# Altium schematic sheet DC075B_USB.SchDoc: USB<->SPI
size 558 x 431 mm; DrawnBy: Praveen Aroul; DocumentNumber: 2; SheetNumber: 2; SheetTotal: 13; PageSetup: Record=PageOptions|CenterHorizontal=True|CenterVertical=True|PrintScale=1.00|XCorrection=1.00|YCorrection=1.00|PrintKind=0|BorderSize=5000000|LeftOffset=0|BottomOffset=0|Orientation=2|PaperLength=1000|PaperWidth=1000|Scale=100|PaperSource=15|PrintQuality=600|MediaType=1|DitherType=10|PaperKind=Letter|PrintScaleMode=1
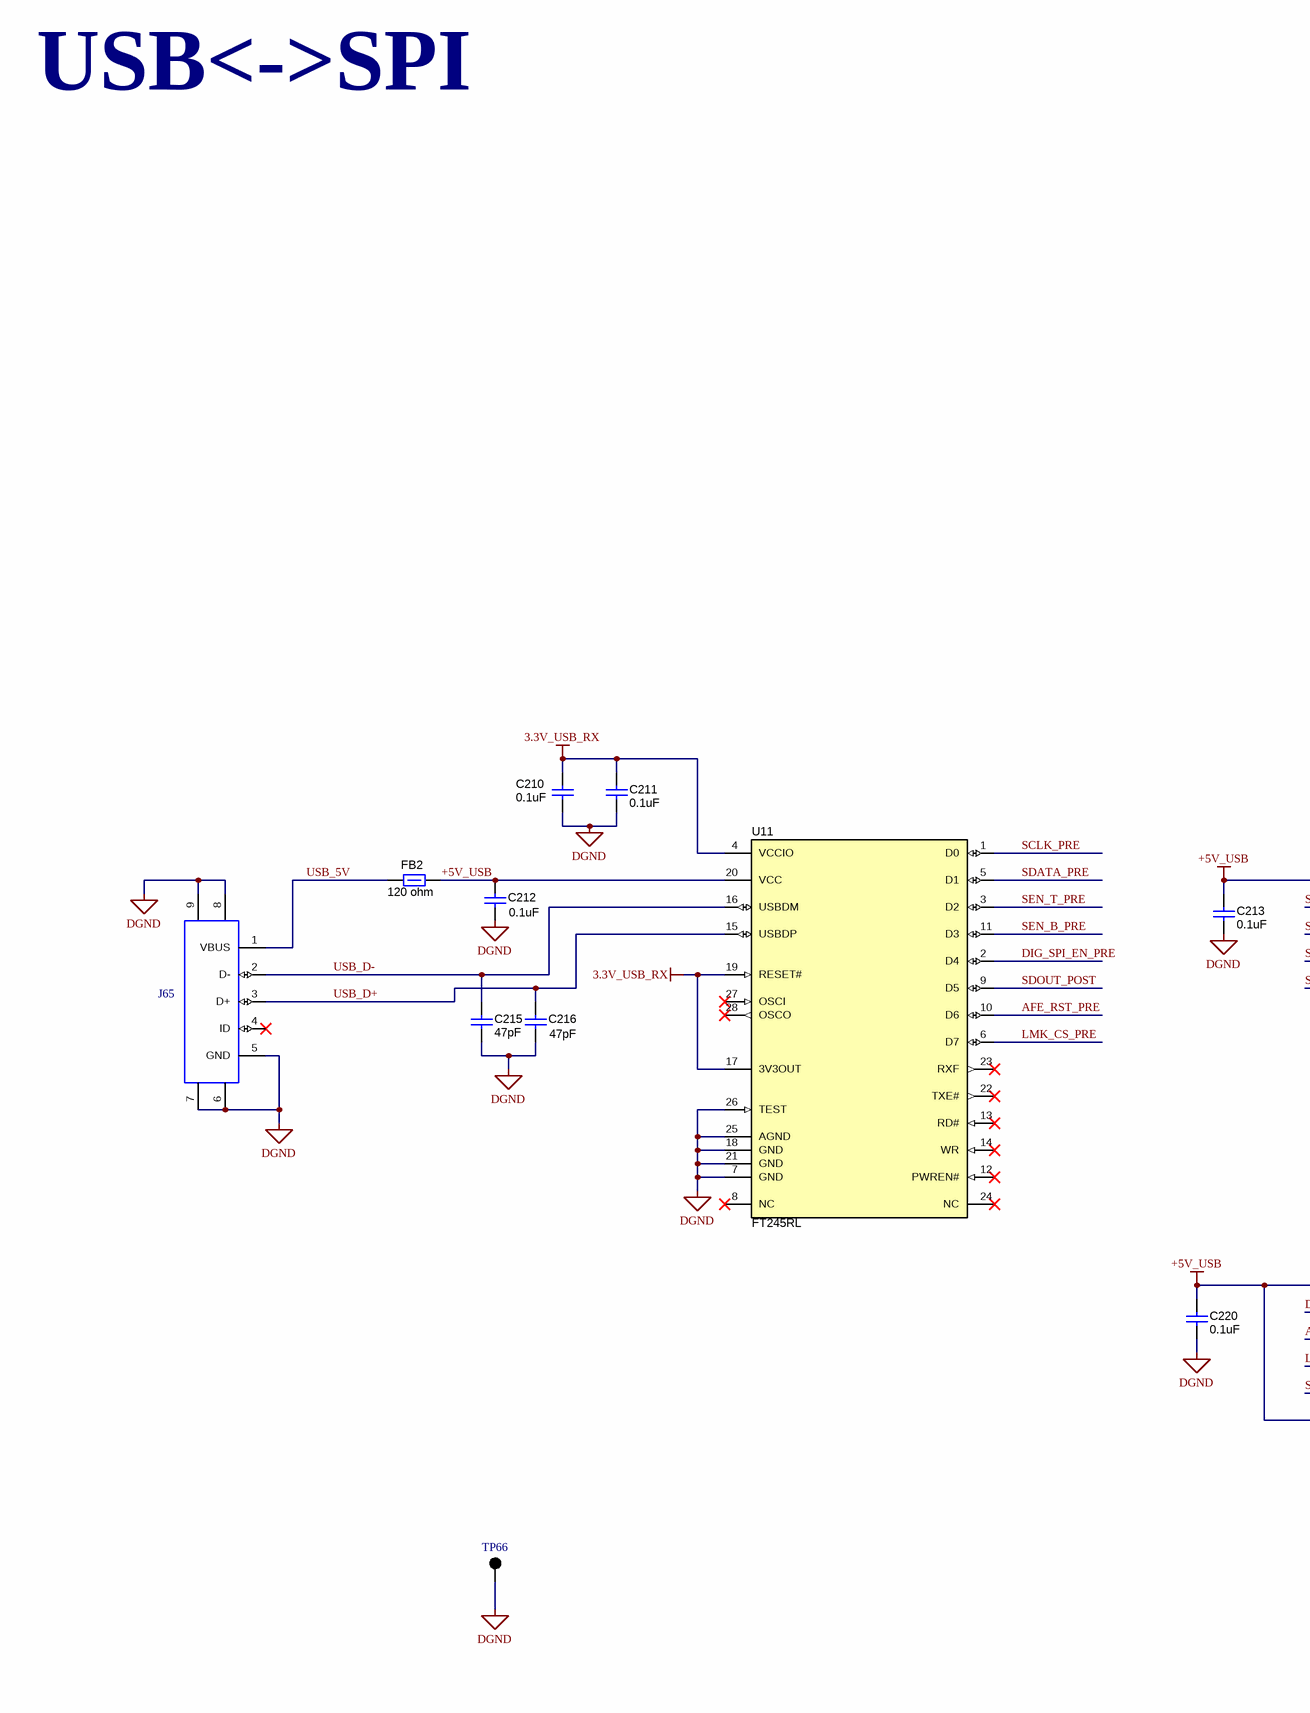
[diagram p0: DC075B_USB.SchDoc, left]
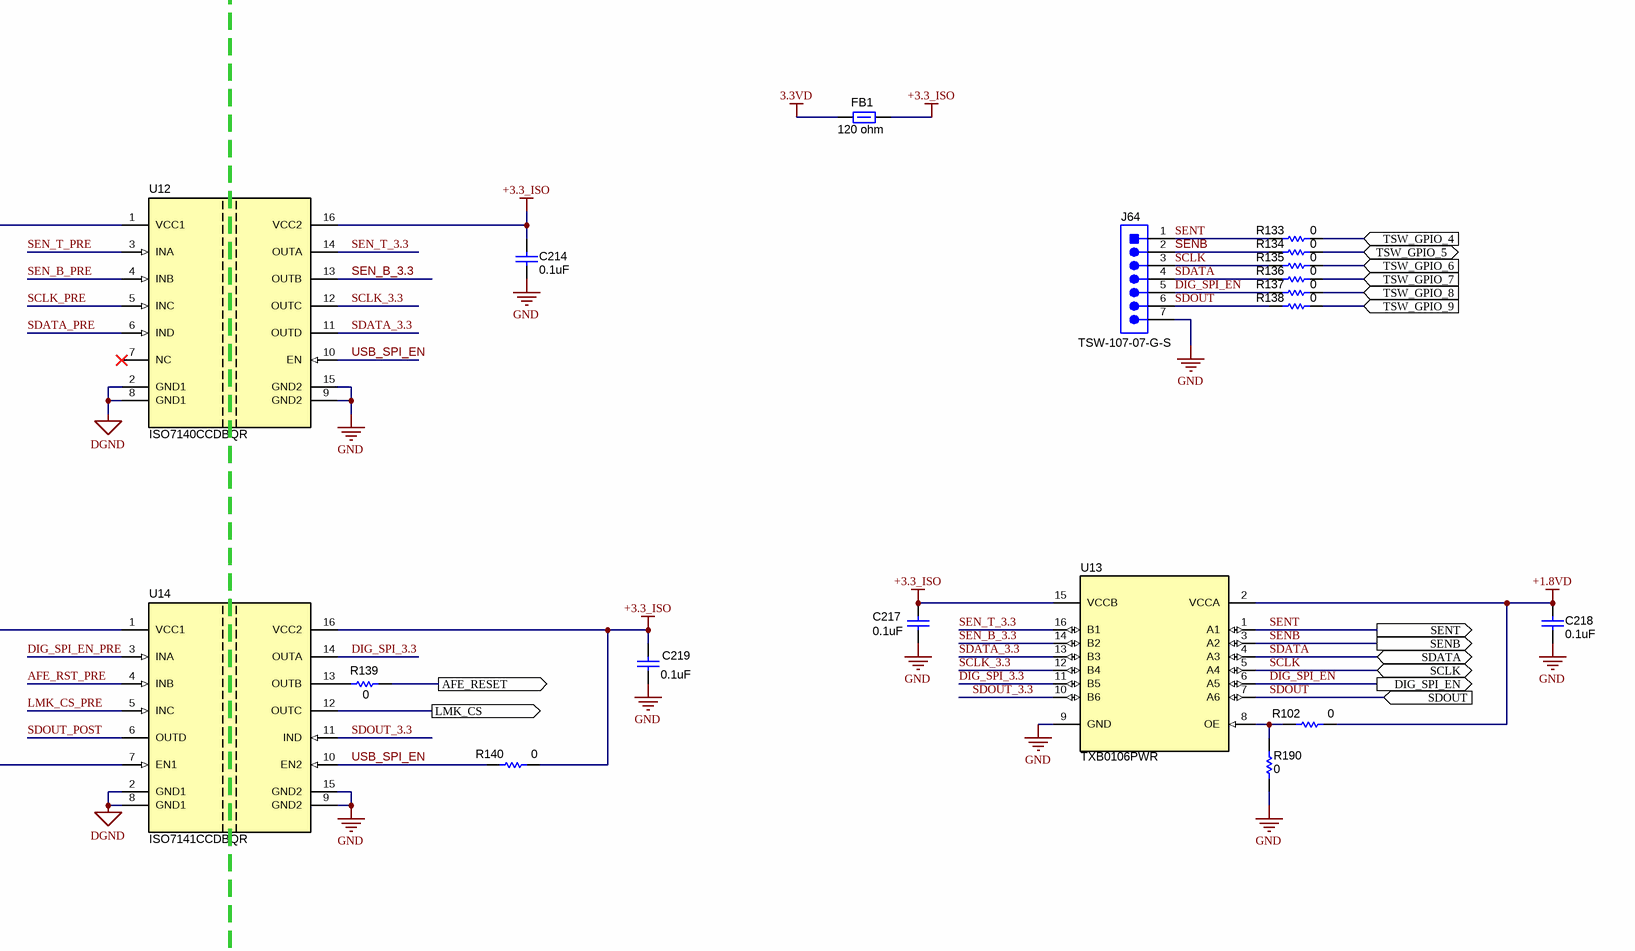
[diagram p1: DC075B_USB.SchDoc, right]

## Parts
C210  value 0.1uF  [0402]  (hidden comment: GRM155R71C104KA88D)
C211  value 0.1uF  [0402]  (hidden comment: GRM155R71C104KA88D)
C212  value 0.1uF  [0402]  (hidden comment: GRM155R71C104KA88D)
C213  value 0.1uF  [0402]  (hidden comment: GRM155R71C104KA88D)
C214  value 0.1uF  [0402]  (hidden comment: GRM155R71C104KA88D)
C215  value 47pF  [0402]  (hidden comment: GRM1555C1H470FA01D)
C216  value 47pF  [0402]  (hidden comment: GRM1555C1H470FA01D)
C217  value 0.1uF  [0402]  (hidden comment: GRM155R71C104KA88D)
C218  value 0.1uF  [0402]  (hidden comment: GRM155R71C104KA88D)
C219  value 0.1uF  [0402]  (hidden comment: GRM155R71C104KA88D)
C220  value 0.1uF  [0402]  (hidden comment: GRM155R71C104KA88D)
FB1  value 120 ohm  [0805]  (hidden comment: BLM21AG121SN1D)
FB2  value 120 ohm  [0805]  (hidden comment: BLM21AG121SN1D)
J64  TSW-107-07-G-S  [TSW-107-07-G-S]
J65  67803-8020  [Molex_67803-8020]  (value not drawn)
R102  value 0  [0402]  (hidden comment: CRCW04020000Z0ED)
R133  value 0  [0402]  (hidden comment: CRCW04020000Z0ED)
R134  value 0  [0402]  (hidden comment: CRCW04020000Z0ED)
R135  value 0  [0402]  (hidden comment: CRCW04020000Z0ED)
R136  value 0  [0402]  (hidden comment: CRCW04020000Z0ED)
R137  value 0  [0402]  (hidden comment: CRCW04020000Z0ED)
R138  value 0  [0402]  (hidden comment: CRCW04020000Z0ED)
R139  value 0  [0402]  (hidden comment: CRCW04020000Z0ED)
R140  value 0  [0402]  (hidden comment: CRCW04020000Z0ED)
R190  value 0  [0402]  (hidden comment: CRCW04020000Z0ED)
TP66  5001  [Keystone5001]  (value not drawn)
U11  FT245RL  [SSOP28_N]
U12  ISO7140CCDBQR  [DBQ0016A_N]
U13  TXB0106PWR  [PW0016A_N]
U14  ISO7141CCDBQR  [DBQ0016A_N]

## Ports
AFE_RESET (out), DIG_SPI_EN (out), LMK_CS (out), SCLK, SDATA, SDOUT (in), SENB (out), SENT (out), TSW_GPIO_4 (in), TSW_GPIO_5, TSW_GPIO_6 (in), TSW_GPIO_7 (in), TSW_GPIO_8 (in), TSW_GPIO_9 (in)

## Nets
3.3V_USB_RX: C210.2 C211.2 U11.4(VCCIO) U11.17(3V3OUT) U11.19(RESET#)
3.3VD: FB1.2
+1.8VD: C218.2 R102.1 U13.2(VCCA)
+3.3_ISO: C214.2 C217.2 C219.2 FB1.1 R140.1 U12.16(VCC2) U13.15(VCCB) U14.16(VCC2)
+5V_USB: C212.1 C213.1 C220.1 FB2.1 U11.20(VCC) U12.1(VCC1) U14.1(VCC1) U14.7(EN1)
DGND: C210.1 C211.1 C212.2 C213.2 C215.2 C216.2 C220.2 J65.5(GND) J65.6 J65.7 J65.8 J65.9 TP66.1 U11.7(GND) U11.18(GND) U11.21(GND) U11.25(AGND) U11.26(TEST) U12.2(GND1) U12.8(GND1) U14.2(GND1) U14.8(GND1)
GND: C214.1 C217.1 C218.1 C219.1 J64.7 R190.2 U12.9(GND2) U12.15(GND2) U13.9(GND) U14.9(GND2) U14.15(GND2)
AFE_RESET: R139.1 ; port AFE_RESET
AFE_RST_PRE: U11.10(D6) U14.4(INB)
DIG_SPI_3.3: U13.11(B5) U14.14(OUTA)
DIG_SPI_EN: J64.5 R137.2 U13.6(A5) ; port DIG_SPI_EN
DIG_SPI_EN_PRE: U11.2(D4) U14.3(INA)
LMK_CS: U14.12(OUTC) ; port LMK_CS
LMK_CS_PRE: U11.6(D7) U14.5(INC)
SCLK: J64.3 R135.2 U13.5(A4) ; port SCLK
SCLK_3.3: U12.12(OUTC) U13.12(B4)
SCLK_PRE: U11.1(D0) U12.5(INC)
SDATA: J64.4 R136.2 U13.4(A3) ; port SDATA
SDATA_3.3: U12.11(OUTD) U13.13(B3)
SDATA_PRE: U11.5(D1) U12.6(IND)
SDOUT: J64.6 R138.2 U13.7(A6) ; port SDOUT
SDOUT_3.3: U13.10(B6) U14.11(IND)
SDOUT_POST: U11.9(D5) U14.6(OUTD)
SEN_B_3.3: U12.13(OUTB) U13.14(B2)
SEN_B_PRE: U11.11(D3) U12.4(INB)
SEN_T_3.3: U12.14(OUTA) U13.16(B1)
SEN_T_PRE: U11.3(D2) U12.3(INA)
SENB: J64.2 R134.2 U13.3(A2) ; port SENB
SENT: J64.1 R133.2 U13.1(A1) ; port SENT
TSW_GPIO_4: R133.1 ; port TSW_GPIO_4
TSW_GPIO_5: R134.1 ; port TSW_GPIO_5
TSW_GPIO_6: R135.1 ; port TSW_GPIO_6
TSW_GPIO_7: R136.1 ; port TSW_GPIO_7
TSW_GPIO_8: R137.1 ; port TSW_GPIO_8
TSW_GPIO_9: R138.1 ; port TSW_GPIO_9
USB_5V: FB2.2 J65.1(VBUS)
USB_D+: C216.1 J65.3(D+) U11.15(USBDP)
USB_D-: C215.1 J65.2(D-) U11.16(USBDM)
USB_SPI_EN: R140.2 U12.10(EN) U14.10(EN2)
NetR102_2: R102.2 R190.1 U13.8(OE)
NetR139_2: R139.2 U14.13(OUTB)

Not connected (* = marked no-connect by the designer): J65 4(ID)*; U11 8(NC)* 12(PWREN#)* 13(RD#)* 14(WR)* 22(TXE#)* 23(RXF)* 24(NC)* 27(OSCI)* 28(OSCO)*; U12 7(NC)*

## Notes on the sheet
- USB<->SPI
- Drawn By:
- SVN Rev:
- Number:
- TID #:
- Orderable:
- Rev:
- Sheet Title:
- File:
- Project Title:
- Designed for:
- Assembly Variant:
- Mod. Date:
- Sheet:
- Size:
- of
- C
- http://www.ti.com
- Texas Instruments and/or its licensors do not warrant the accuracy or completeness of this specification or any information contained therein. Texas Instruments and/or its licensors do not warrant that this design will meet the specifications, will be suitable for your application or fit for any particular purpose, or will operate in an implementation. Texas Instruments and/or its licensors do not warrant that the design is production worthy. You should completely validate and test your design implementation to confirm the system functionality for your application.
- Engineer:
- Contact:
- © Texas Instruments

## Library data of the parts
C210-C214 C217-C220 = CMP-0006641-2: CAP, CERM, 0.1 uF, 16 V, +/- 10%, X7R, 0402; Manufacturer: MuRata; Polarized: N; U/M: EA; Cap_F: 100nF; Value1: Unknown; VDC_V: 16V; TaMin_C: -55°C; TaMax_C: 125°C; AEC Category: Q200; SizeArea_mm2: 0.5; SizeAreaWB_mm2: 3; SizeX_mm: 1; SizeZ_mm: 0.6; CompType: Capacitor; PartNumber: GRM155R71C104KA88D; PackageReference: 0402; RoHS: Y; MountType: SMT; ComponentLink1Description: Datasheet link; ComponentLink1URL: http://search.murata.co.jp/Ceramy/PnsearchViewAction.do?HnOFG=ON&HnNFG=ON&SEL_CNT=50&sLang=en&sKey=GRM155R71C104KA88D&x=9&y=9&search=startwith; ValueDisplayed: 0.1uF; Tolerance_%: 10%; Value2: 16V; Technology: Ceramic; TempCo: X7R; Cap_Case: 0402; Published: 2008-06-19; Publisher: Texas Instruments; LatestRevisionDate: 2017-03-09; Supplier 1: Digi-Key; Supplier Part Number 1: 490-3261-1-ND; Supplier 2: Newark; Supplier Part Number 2: 38K1647; Supplier 3: Mouser; Supplier Part Number 3: 81-GRM155R71C104KA88; AEC Qualified: ?; SizeY_mm: 0.5
C215 C216 = CMP-0006467-2: CAP, CERM, 47 pF, 50 V, +/- 1%, C0G/NP0, 0402; Manufacturer: MuRata; Polarized: N; U/M: EA; Value1: Unknown; VDC_V: 50V; TaMin_C: -55°C; TaMax_C: 125°C; AEC Category: Q200; SizeArea_mm2: 0.5; SizeAreaWB_mm2: 3; SizeX_mm: 1; SizeZ_mm: 0.6; CompType: Capacitor; PartNumber: GRM1555C1H470FA01D; PackageReference: 0402; RoHS: Y; MountType: SMT; ComponentLink1Description: Datasheet link; ComponentLink1URL: http://www.murata.com/~/media/webrenewal/support/library/catalog/products/capacitor/mlcc/c02e.ashx; ValueDisplayed: 47pF; Cap_F: 47pF; Tolerance_%: 1%; Value2: 50V; Technology: Ceramic; TempCo: C0G/NP0; Cap_Case: 0402; Published: 2008-06-19; Publisher: Texas Instruments; LatestRevisionDate: 2017-03-09; Supplier 1: Digi-Key; Supplier Part Number 1: 490-6241-1-ND; Supplier 2: Mouser; Supplier Part Number 2: 81-GRM1555C1H470FA1D; AEC Qualified: ?; SizeY_mm: 0.5
FB1 FB2 = CMP-0003358-1: Ferrite Bead, 120 ohm @ 100 MHz, 0.8 A, 0805; Manufacturer: MuRata; Imax_A: 8dA; DCR_ohm: 1d; Value1: 0.1 ohm; Value2: 0.8A; ZTyp@100MHz_Ohm: 120; SizeArea_mm2: 2.5; SizeAreaWB_mm2: 6.75; SizeX_mm: 2; SizeY_mm: 1.25; SizeZ_mm: 1.45; ComponentLink1Description: Datasheet link; ComponentLink1URL: http://search.murata.co.jp/Ceramy/image/img/PDF/ENG/L0110S0100BLM21A.pdf; CompType: Ferrite Bead; MountType: SMT; PackageReference: 0805; PartNumber: BLM21AG121SN1D; RoHS: Y; Published: 2014-04-30; Publisher: Texas Instruments; LatestRevisionDate: 2017-03-09; Supplier 1: Digi-Key; Supplier Part Number 1: 490-1038-1-ND; Supplier 2: Newark; Supplier Part Number 2: 73M9128; Supplier 3: Mouser; Supplier Part Number 3: 81-BLM21AG121SN1D; ValueDisplayed: 120 ohm
J64 = CMP-0075416-1: Header, 100mil, 7x1, Gold, TH; Manufacturer: Samtec; Pitch_mm: 2.54; Gender: Male; Shrouded: N; Row_Count: 1; Current_A: 6.3A; Voltage_V: 550V; Cert_CSA: Y; CNHeader: True; CT: False; Green_Lifecycle: Active; Green_REACh: Passed; PartNumber: TSW-107-07-G-S; PackageReference: 7x1 Header; ClassName: Header; CompType: Header; RoHS: Y; MountType: TH; ComponentLink1Description: Datasheet URL; ComponentLink1URL: http://samtec.com/ftppub/pdf/TSW_TH.PDF; Orientation: Vertical; PinCount: 7; ContactFinish: Gold; Color: Black; Cert_UL: Y; Cert_CULUS: N; Cert_VDE: N; Publisher: Texas Instruments; LatestRevisionDate: 2017-07-12; Supplier 1: Digi-Key; Supplier Part Number 1: SAM1029-07-ND; Green_EU RoHS-2: Passed; Green_EU RoHS: Passed
J65 = CMP-0055303-1: Connector, Receptacle, USB - mini AB, R/A, SMD; Manufacturer: Molex; CNHeader: FALSE; CT: TRUE; Gender: Female; PartNumber: 67803-8020; PackageReference: Receptacle, 5-Leads, Body 9.9x9mm, R/A; CompType: USB; RoHS: Y; MountType: SMT; ComponentLink1Description: Datasheet URL; ComponentLink1URL: http://www.molex.com/pdm_docs/sd/678038020_sd.pdf; Publisher: Texas Instruments; LatestRevisionDate: 26/05/2017; Supplier 1: Digi-Key; Supplier Part Number 1: WM17148CT-ND; Supplier 2: Newark; Supplier Part Number 2: 06X9412; Supplier 3: Mouser; Supplier Part Number 3: 538-67803-8020
R102 R133-R140 R190 = CMP-0026822-3: RES, 0, 5%, 0.063 W, AEC-Q200 Grade 0, 0402; Manufacturer: Vishay-Dale; Value_Code: 0000; Power_W: 63mW; Value2: 0.063W; VDC_V: 50V; TempCo: 200 ppm/C; EIA_Code: E24; AEC Category: Q200; AEC Qualified: Y; SizeArea_mm2: 0.5; SizeX_mm: 1; SizeZ_mm: 0.6; ComponentLink1Description: Datasheet link; ComponentLink1URL: http://www.vishay.com/docs/20035/dcrcwe3.pdf; CompType: Resistor; MountType: SMT; PackageReference: 0402; PartNumber: CRCW04020000Z0ED; RoHS: E; ValueDisplayed: 0; Res_ohm: 0; Tolerance_%: 5%; Value1: 5%; Technology: Thick Film; Supplier 1: Digi-Key; Supplier Part Number 1: 541-0.0JCT-ND; Supplier 2: Newark; Supplier Part Number 2: 52K6543; Supplier 3: Mouser; Supplier Part Number 3: 71-CRCW0402-0-E3; AEC Grade: 0; SizeY_mm: 0.5
TP66 = CMP-0055138-1: Test Point, Miniature, Black, TH; Manufacturer: Keystone; CNHeader: FALSE; ContactFinish: Silver; CT: TRUE; Green_Lifecycle: Active; Green_REACh: Passed; PartNumber: 5001; PackageReference: Black Miniature Testpoint; CompType: Test Point; RoHS: Y; MountType: TH; ComponentLink1Description: Datasheet URL; ComponentLink1URL: http://www.keyelco.com/userAssets/file/M60-2p60.pdf; Publisher: Texas Instruments; LatestRevisionDate: 26/05/2017; Supplier 1: Digi-Key; Supplier Part Number 1: 36-5001-ND; Supplier 2: Mouser; Supplier Part Number 2: 534-5001; Color: Black; Green_EU RoHS-2: Incomplete; Green_EU RoHS: Passed
U11 = CMP-0004746-1: USB FIFO IC, 28SSOP; Manufacturer: FTDI; PartNumber: FT245RL; MountType: SMT; ComponentLink1Description: Datasheet URL; ComponentLink1URL: http://www.ftdichip.com/Support/Documents/DataSheets/ICs/DS_FT245R.pdf; RoHS: Y; PackageReference: SSOP28; Publisher: Texas Instruments; LatestRevisionDate: 09/03/2017; Supplier 1: Digi-Key; Supplier Part Number 1: 768-1011-1-ND; Supplier 2: Newark; Supplier Part Number 2: 91K9920; Supplier 3: Mouser; Supplier Part Number 3: 895-FT245RL
U12 = CMP-0065825-1: 4242-VPK Small-Footprint and Low-Power 4/0 Quad Channel Digital Isolator with Noise Filter, DBQ0016A (SSOP-16); Manufacturer: Texas Instruments; CompType: IC; U/M: EA; SizeArea_mm2: 60.0; SizeAreaWB_mm2: 96.0; SizeX_mm: 6.0; SizeY_mm: 10.0; SizeZ_mm: 1.75; PartNumber: ISO7140CCDBQR; Alternate PartNumber: ISO7140CCDBQ; PackageReference: DBQ0016A; MountType: SMT; ComponentLink1Description: Datasheet Link; ComponentLink1URL: http://www.ti.com/lit/ds/symlink/iso7141cc.pdf; RoHS: Y; Publisher: Texas Instruments; LatestRevisionDate: 2017-06-09; Alternate Manufacturer: Texas Instruments; Footprint Path 6: C:\AltiumLibraries\Footprints\TI\.PcbLib; PackageDescription: SSOP-16
U13 = CMP-0067443-1: 6-Bit Bidirectional Voltage-Level Translator with Auto Direction Sensing and +/-15-kV ESD Protect, PW0016A (TSSOP-16); Manufacturer: Texas Instruments; CompType: IC; U/M: EA; Green_Lifecycle: Active; Green_REACh: Passed; SizeArea_mm2: 32.0; SizeAreaWB_mm2: 58.8; SizeX_mm: 6.4; SizeY_mm: 5.0; SizeZ_mm: 1.2; PartNumber: TXB0106PWR; PackageReference: PW0016A; MountType: SMT; ComponentLink1Description: Datasheet Link; ComponentLink1URL: http://www.ti.com/lit/ds/symlink/txb0106.pdf; RoHS: Y; Publisher: Texas Instruments; LatestRevisionDate: 2017-06-09; Alternate Manufacturer: Texas Instruments; Footprint Path 6: C:\AltiumLibraries\Footprints\TI\.PcbLib; Green_EU RoHS-2: Passed; Green_EU RoHS: Passed; PackageDescription: TSSOP-16
U14 = CMP-0065826-1: 4242-VPK Small-Footprint and Low-Power 3/1 Quad Channel Digital Isolator with Noise Filter, DBQ0016A (SSOP-16); Manufacturer: Texas Instruments; CompType: IC; U/M: EA; SizeArea_mm2: 60.0; SizeAreaWB_mm2: 96.0; SizeX_mm: 6.0; SizeY_mm: 10.0; SizeZ_mm: 1.75; PartNumber: ISO7141CCDBQR; Alternate PartNumber: ISO7141CCDBQ; PackageReference: DBQ0016A; MountType: SMT; ComponentLink1Description: Datasheet Link; ComponentLink1URL: http://www.ti.com/lit/ds/symlink/iso7141cc.pdf; RoHS: Y; Publisher: Texas Instruments; LatestRevisionDate: 2017-06-09; Alternate Manufacturer: Texas Instruments; Footprint Path 6: C:\AltiumLibraries\Footprints\TI\.PcbLib; PackageDescription: SSOP-16